# EAGLE design ESC (EAGLE 9.5.1)
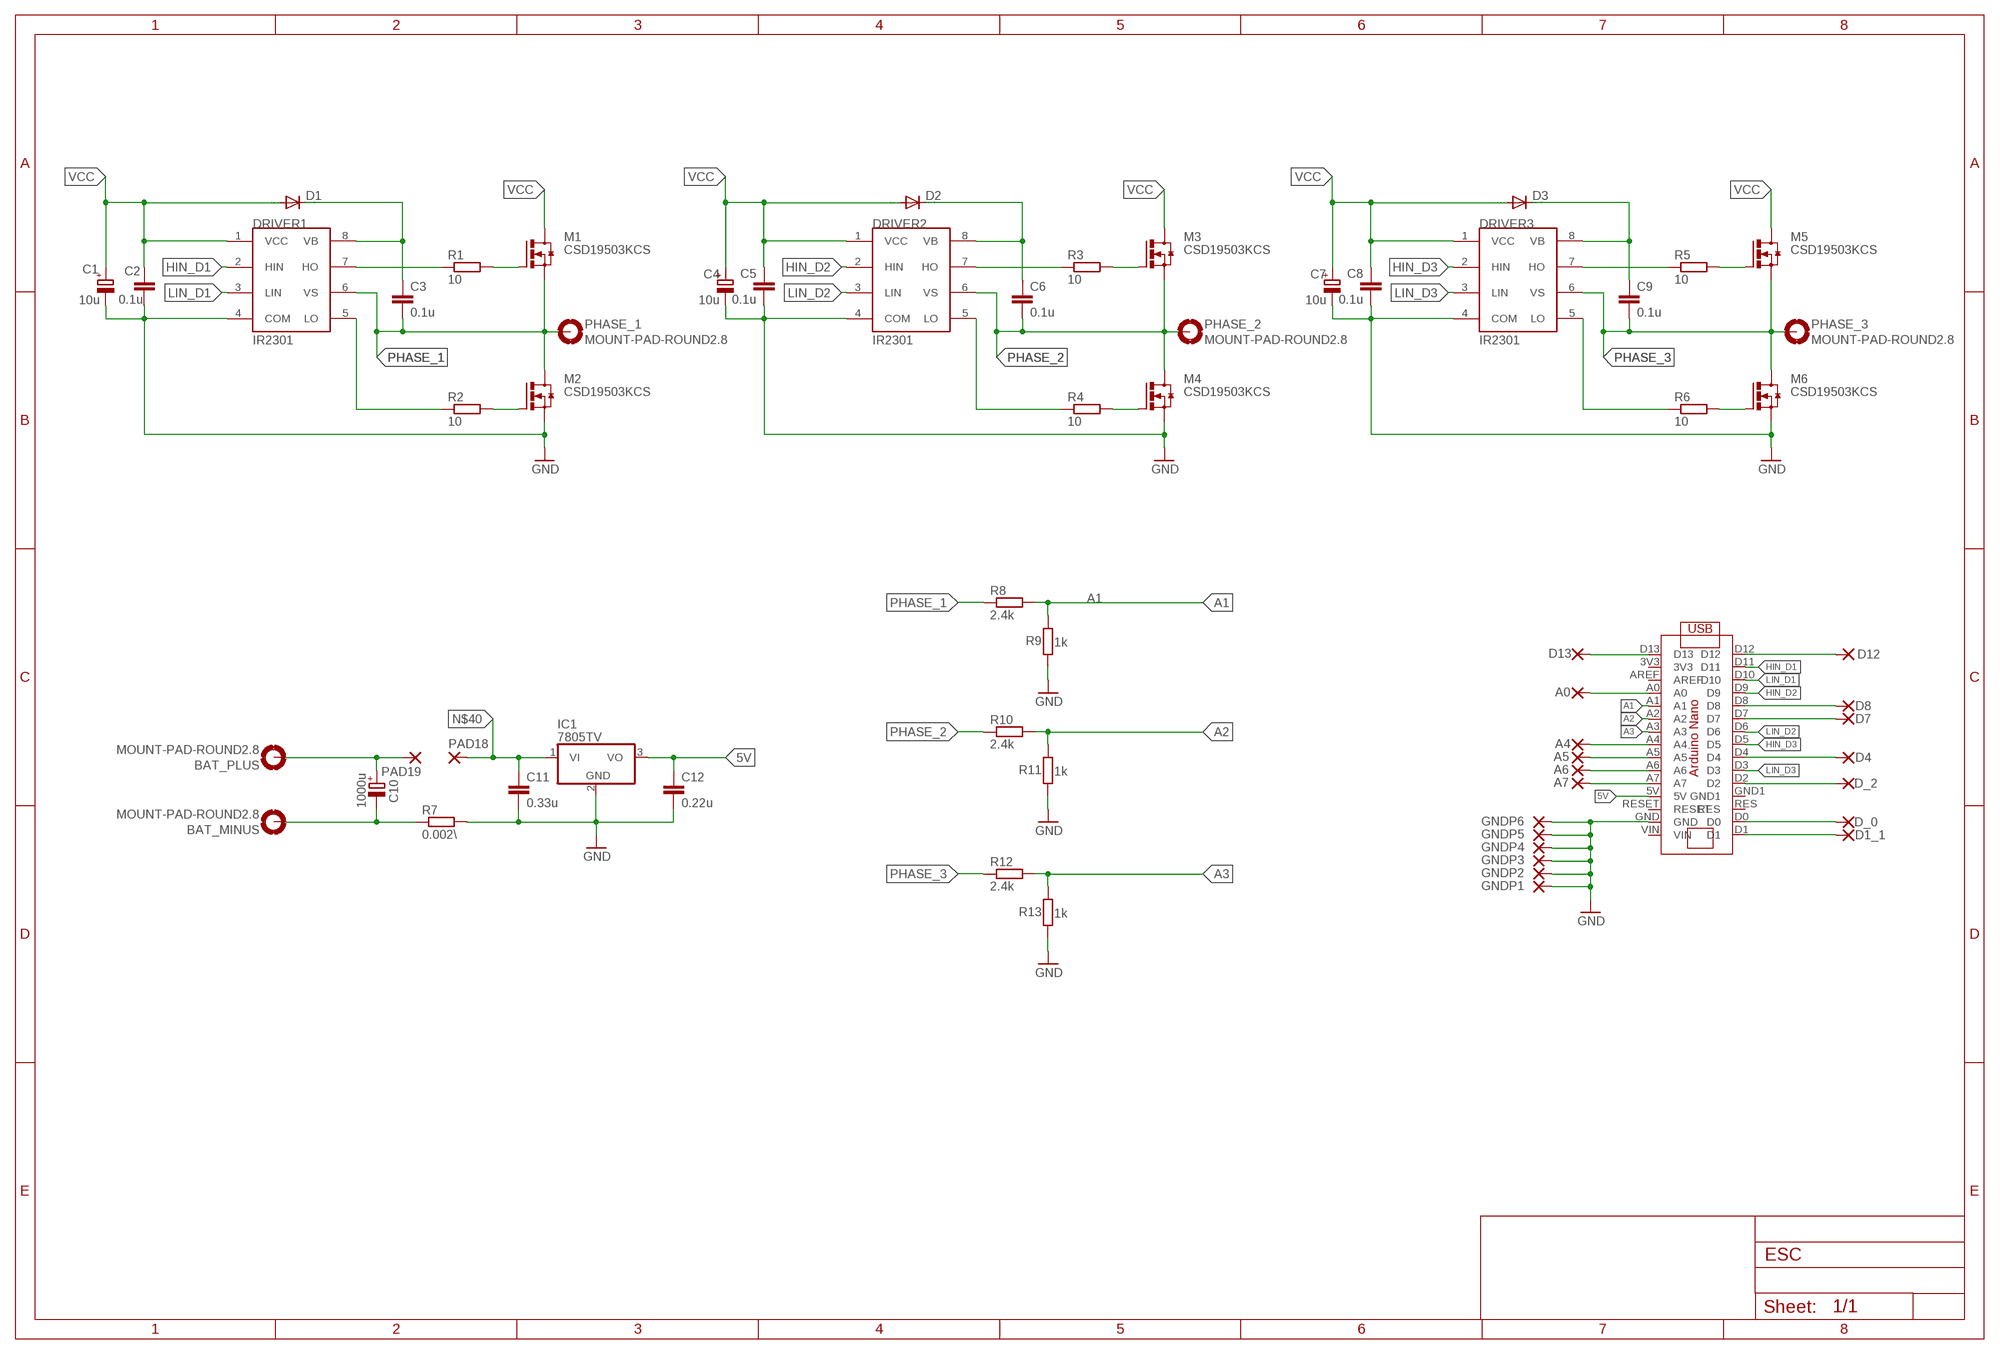
[diagram p0: schematic, sheet 1]

## Parts
A0  3,81/1,4  [3,81/1,4]
A4  3,81/1,4  [3,81/1,4]
A5  3,81/1,4  [3,81/1,4]
A6  3,81/1,4  [3,81/1,4]
A7  3,81/1,4  [3,81/1,4]
BAT_MINUS  MOUNT-PAD-ROUND2.8  [2,8-PAD]
BAT_PLUS  MOUNT-PAD-ROUND2.8  [2,8-PAD]
C1  10u  CPOL-EUC  [PANASONIC_C]
C2  0.1u  CC1206  [C1206]
C3  0.1u  CC1206  [C1206]
C4  10u  CPOL-EUC  [PANASONIC_C]
C5  0.1u  CC1206  [C1206]
C6  0.1u  CC1206  [C1206]
C7  10u  CPOL-EUC  [PANASONIC_C]
C8  0.1u  CC1206  [C1206]
C9  0.1u  CC1206  [C1206]
C10  1000u  CPOL-EUE7.5-16  [E7,5-16]
C11  0.33u  CC1206  [C1206]
C12  0.22u  CC1206  [C1206]
D1  DIODE-DO41-10  [DO41-10]
D1_1  3,81/1,4  [3,81/1,4]
D2  DIODE-DO41-10  [DO41-10]
D3  DIODE-DO41-10  [DO41-10]
D4  3,81/1,4  [3,81/1,4]
D7  3,81/1,4  [3,81/1,4]
D8  3,81/1,4  [3,81/1,4]
D12  3,81/1,4  [3,81/1,4]
D13  3,81/1,4  [3,81/1,4]
D_0  3,81/1,4  [3,81/1,4]
D_2  3,81/1,4  [3,81/1,4]
DRIVER1  IR2301  [DIL08]
DRIVER2  IR2301  [DIL08]
DRIVER3  IR2301  [DIL08]
GNDP1  3,81/1,4  [3,81/1,4]
GNDP2  3,81/1,4  [3,81/1,4]
GNDP3  3,81/1,4  [3,81/1,4]
GNDP4  3,81/1,4  [3,81/1,4]
GNDP5  3,81/1,4  [3,81/1,4]
GNDP6  3,81/1,4  [3,81/1,4]
IC1  7805TV  [TO220V]
M1  CSD19503KCS  [TO220BV]
M2  CSD19503KCS  [TO220BV]
M3  CSD19503KCS  [TO220BV]
M4  CSD19503KCS  [TO220BV]
M5  CSD19503KCS  [TO220BV]
M6  CSD19503KCS  [TO220BV]
PAD18  3,81/1,4  [3,81/1,4]
PAD19  3,81/1,4  [3,81/1,4]
PHASE_1  MOUNT-PAD-ROUND2.8  [2,8-PAD]
PHASE_2  MOUNT-PAD-ROUND2.8  [2,8-PAD]
PHASE_3  MOUNT-PAD-ROUND2.8  [2,8-PAD]
R1  10  R-EU_R1206  [R1206]
R2  10  R-EU_R1206  [R1206]
R3  10  R-EU_R1206  [R1206]
R4  10  R-EU_R1206  [R1206]
R5  10  R-EU_R1206  [R1206]
R6  10  R-EU_R1206  [R1206]
R7  0.002\  R-EU_R2512  [R2512]
R8  2.4k  R-EU_R1206  [R1206]
R9  1k  R-EU_R1206  [R1206]
R10  2.4k  R-EU_R1206  [R1206]
R11  1k  R-EU_R1206  [R1206]
R12  2.4k  R-EU_R1206  [R1206]
R13  1k  R-EU_R1206  [R1206]
U$7  ARDUINO-NANO  [ARDUINO-NANO]

## Nets
5V: C12.1 IC1.3(VO) U$7.5V
A1: R8.2 R9.2 U$7.A1
A2: R10.2 R11.2 U$7.A2
A3: R12.2 R13.2 U$7.A3
BAT_MINUS: BAT_MINUS.B2,8(MOUNT) C10.- R7.1
D22: D_2.1(P) U$7.D2
GND: C1.- C2.2 C4.- C5.2 C7.- C8.2 C11.2 C12.2 DRIVER1.4(COM) DRIVER2.4(COM) DRIVER3.4(COM) GNDP1.1(P) GNDP2.1(P) GNDP3.1(P) GNDP4.1(P) GNDP5.1(P) GNDP6.1(P) IC1.2(GND) M2.S M4.S M6.S R7.2 R9.1 R11.1 R13.1 U$7.GND
HIN_D1: DRIVER1.2(HIN) U$7.D11
HIN_D2: DRIVER2.2(HIN) U$7.D9
HIN_D3: DRIVER3.2(HIN) U$7.D5
LIN_D1: DRIVER1.3(LIN) U$7.D10
LIN_D2: DRIVER2.3(LIN) U$7.D6
LIN_D3: DRIVER3.3(LIN) U$7.D3
N$1: DRIVER2.7(HO) R3.1
N$2: DRIVER2.5(LO) R4.1
N$3: M3.G R3.2
N$4: D13.1(P) U$7.D13
N$5: DRIVER3.7(HO) R5.1
N$6: DRIVER3.5(LO) R6.1
N$9: A0.1(P) U$7.A0
N$10: A4.1(P) U$7.A4
N$11: A5.1(P) U$7.A5
N$12: A6.1(P) U$7.A6
N$13: A7.1(P) U$7.A7
N$14: D4.1(P) U$7.D4
N$15: DRIVER1.7(HO) R1.1
N$16: D7.1(P) U$7.D7
N$17: D8.1(P) U$7.D8
N$18: DRIVER1.5(LO) R2.1
N$19: M4.G R4.2
N$20: M5.G R5.2
N$21: D12.1(P) U$7.D12
N$22: M6.G R6.2
N$24: D_0.1(P) U$7.D0
N$25: D1_1.1(P) U$7.D1
N$26: M1.G R1.2
N$28: M2.G R2.2
N$40: C11.1 IC1.1(VI) PAD18.1(P)
PHASE_1: C3.2 DRIVER1.6(VS) M1.S M2.D PHASE_1.B2,8(MOUNT) R8.1
PHASE_2: C6.2 DRIVER2.6(VS) M3.S M4.D PHASE_2.B2,8(MOUNT) R10.1
PHASE_3: C9.2 DRIVER3.6(VS) M5.S M6.D PHASE_3.B2,8(MOUNT) R12.1
VB1: C3.1 D1.C DRIVER1.8(VB)
VB2: C6.1 D2.C DRIVER2.8(VB)
VB3: C9.1 D3.C DRIVER3.8(VB)
VCC: BAT_PLUS.B2,8(MOUNT) C1.+ C2.1 C4.+ C5.1 C7.+ C8.1 C10.+ D1.A D2.A D3.A DRIVER1.1(VCC) DRIVER2.1(VCC) DRIVER3.1(VCC) M1.D M3.D M5.D PAD19.1(P)
Unconnected: U$7.3V3 U$7.AREF U$7.GND1 U$7.RES U$7.RESET U$7.VIN

## Library data of the parts
A0 A4-A7 D1_1 D4 D7 D8 D12 D13 D_0 D_2 GNDP1-GNDP6 PAD18 PAD19 = wirepad:3,81/1,4: THROUGH-HOLE PAD
BAT_MINUS BAT_PLUS PHASE_1-PHASE_3 = holes:MOUNT-PAD-ROUND: MOUNTING PAD, round
C1 C4 C7 C10 = resistor:CPOL-EU: POLARIZED CAPACITOR, European symbol
C2 C3 C5 C6 C8 C9 C11 C12 = Kondensator.:C: KONDENSATOR
D1-D3 = diode:DIODE-: DIODE
DRIVER1-DRIVER3 = kirill:IR2301: High and low side driver; AVAILABILITY: Unavailable; DESCRIPTION: High and Low Side Driver, Noninverting Inputs; MF: Infineon; MP: IR2301; PACKAGE: DIP-8 International Rectifier; PRICE: None
IC1 = linear:78*: Positive VOLTAGE REGULATOR Source: http://cache.national.com/ds/LM/LM78L05.pdf http://www.fairchildsemi.com/ds/LM/LM7805.pdf
M1 = CSD19503KCS:CSD19503KCS: Power Mosfet, Texas Instrument; SPICEPREFIX: M
M2-M6 = CSD19503KCS:CSD19503KCS: Power Mosfet, Texas Instrument
R1-R6 R8-R13 = Widerstände:R-EU_: RESISTOR; SPICEPREFIX: R
R7 = rcl:R-EU_: RESISTOR, European symbol; SPICEPREFIX: R
U$7 = Arduino-nano:ARDUINO-NANO

## Net classes
1 New Class: width 7 mm, clearance 0.203 mm

## Board
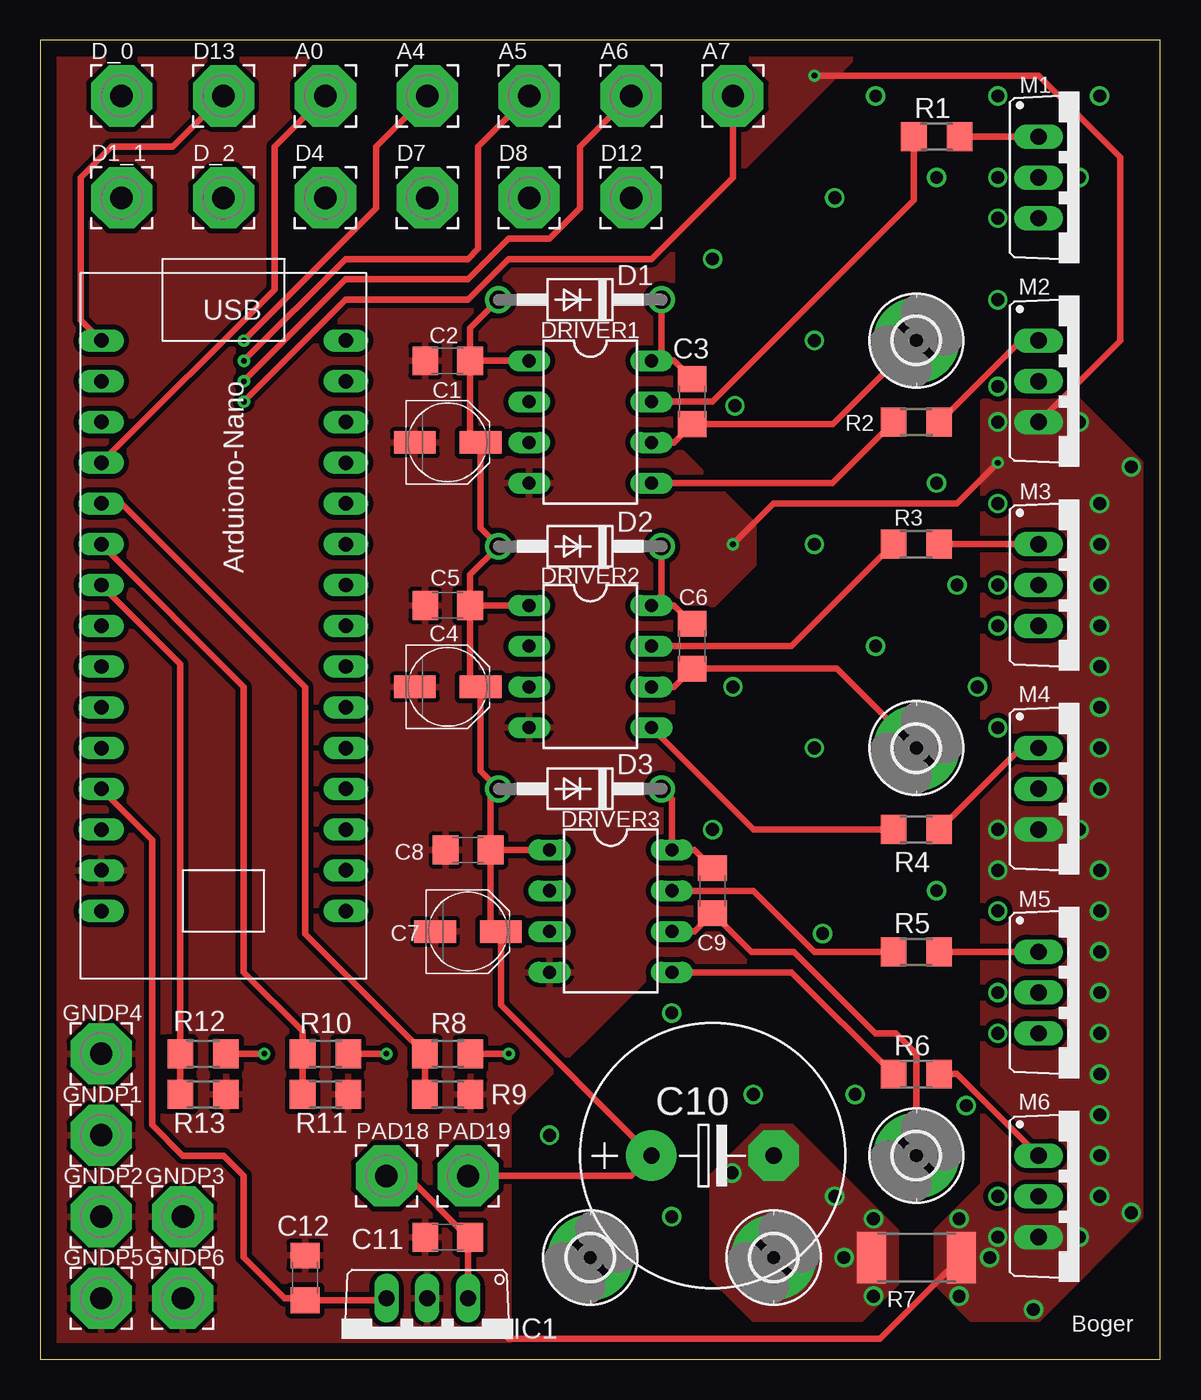
[diagram p1: board, top side]
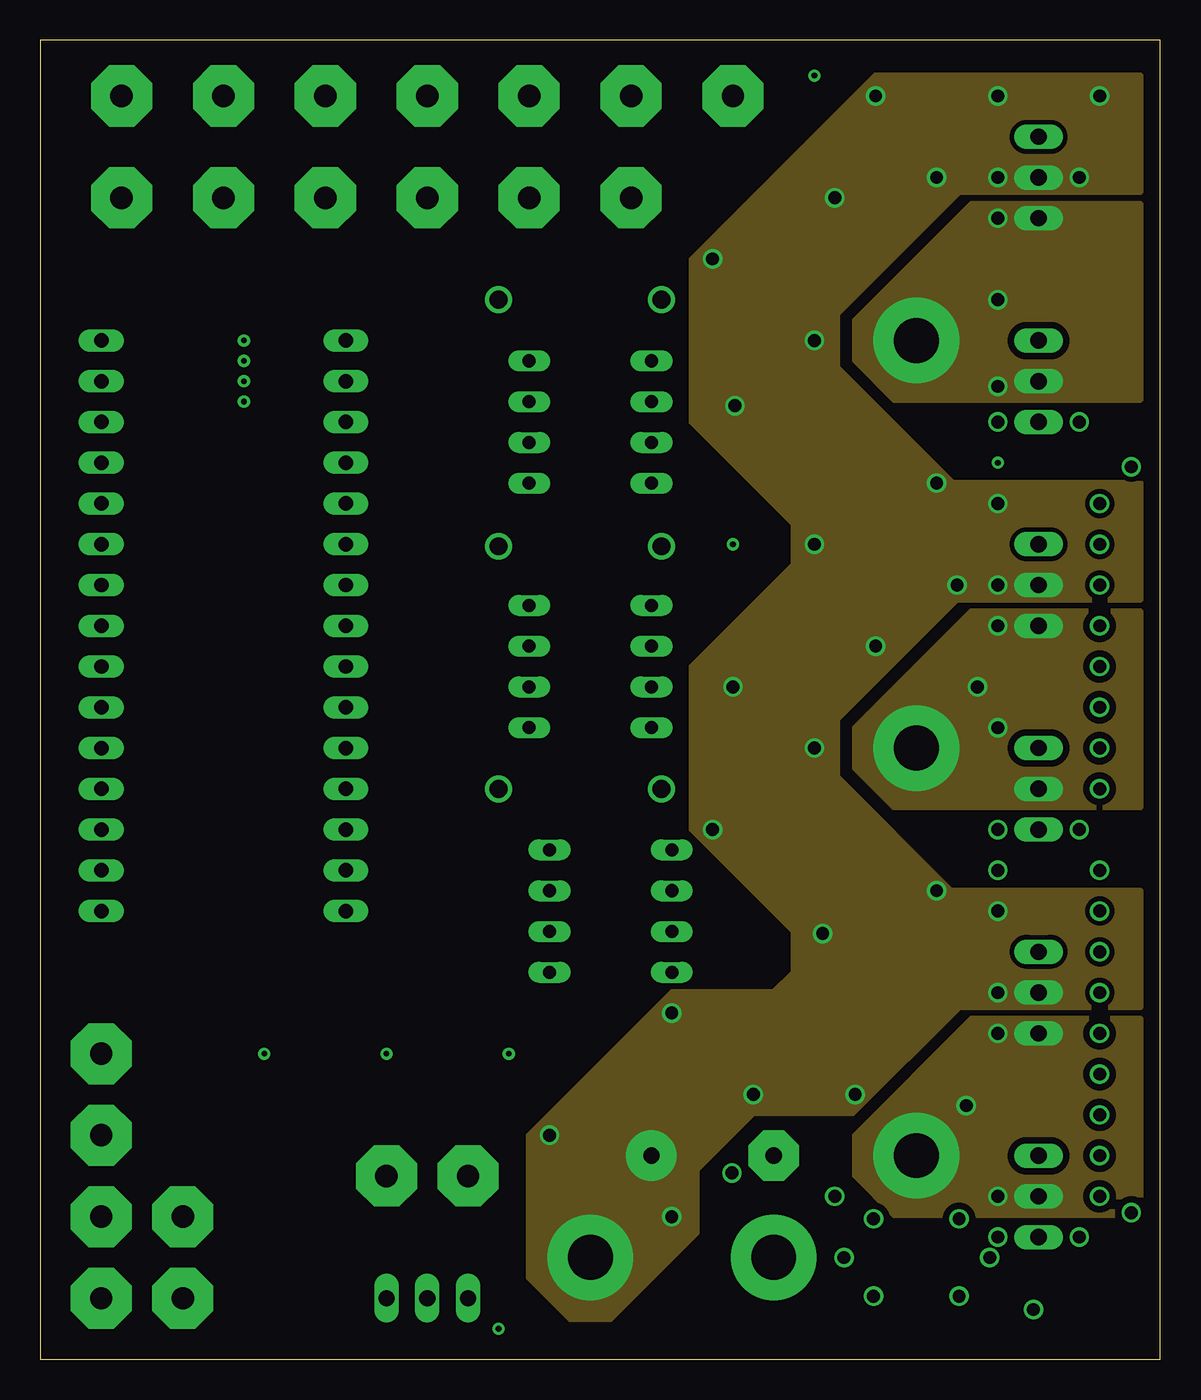
[diagram p2: board, inner layer Route2]
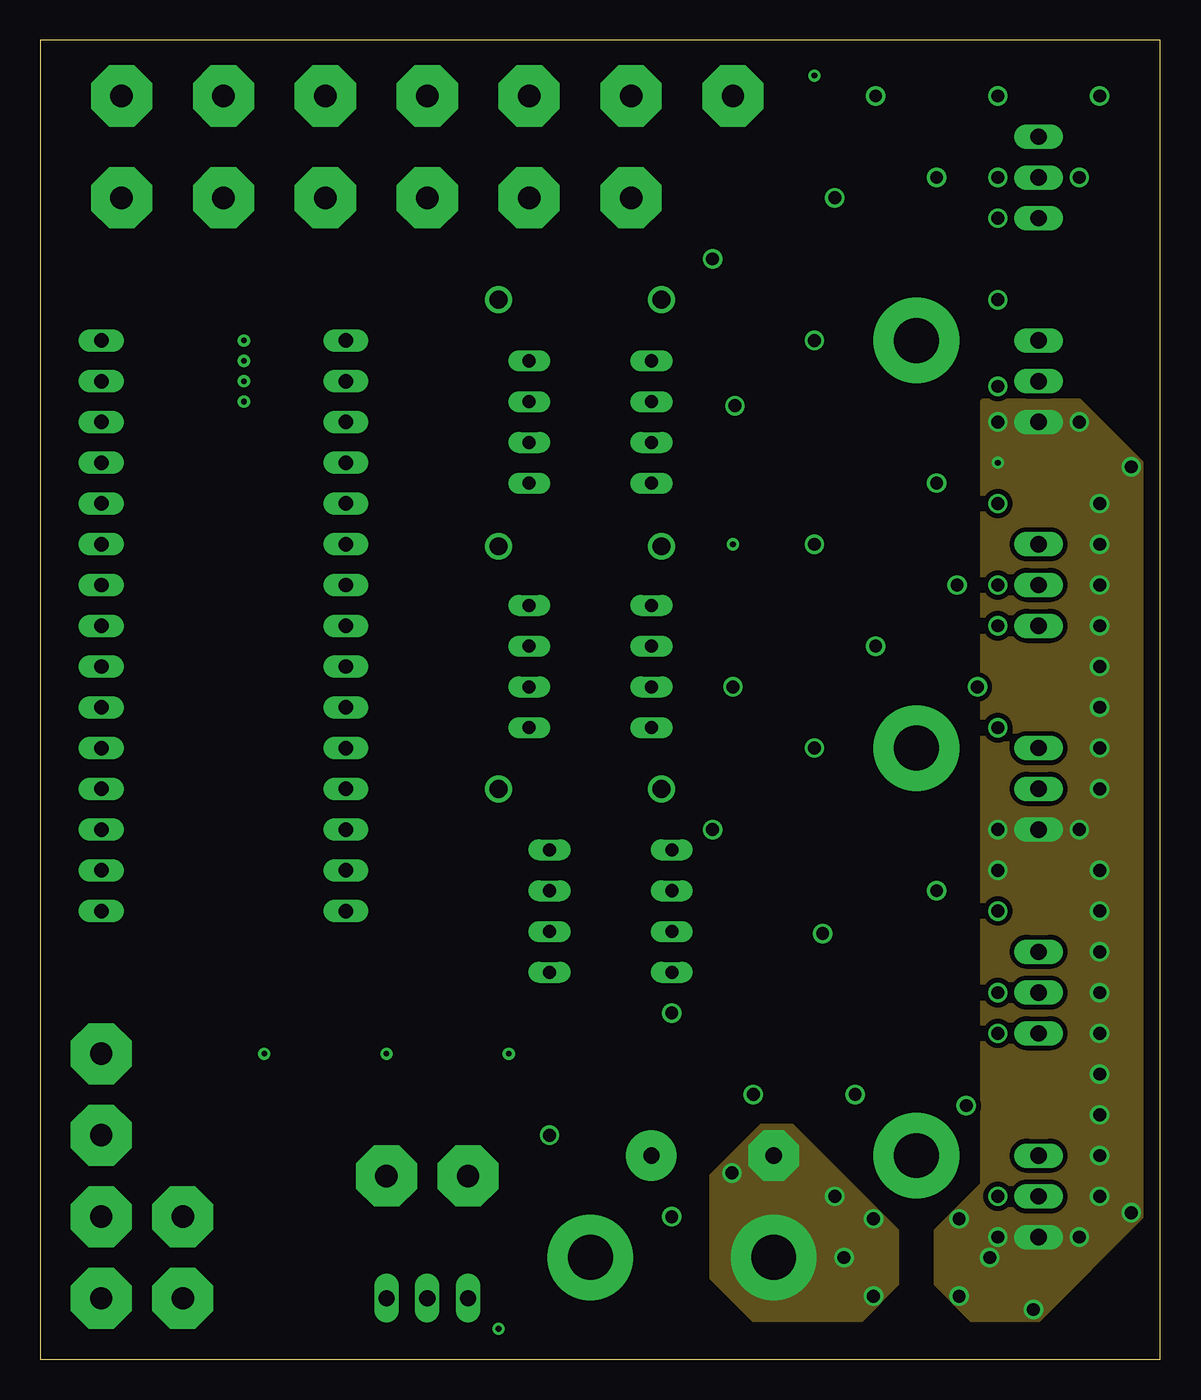
[diagram p3: board, inner layer Route15]
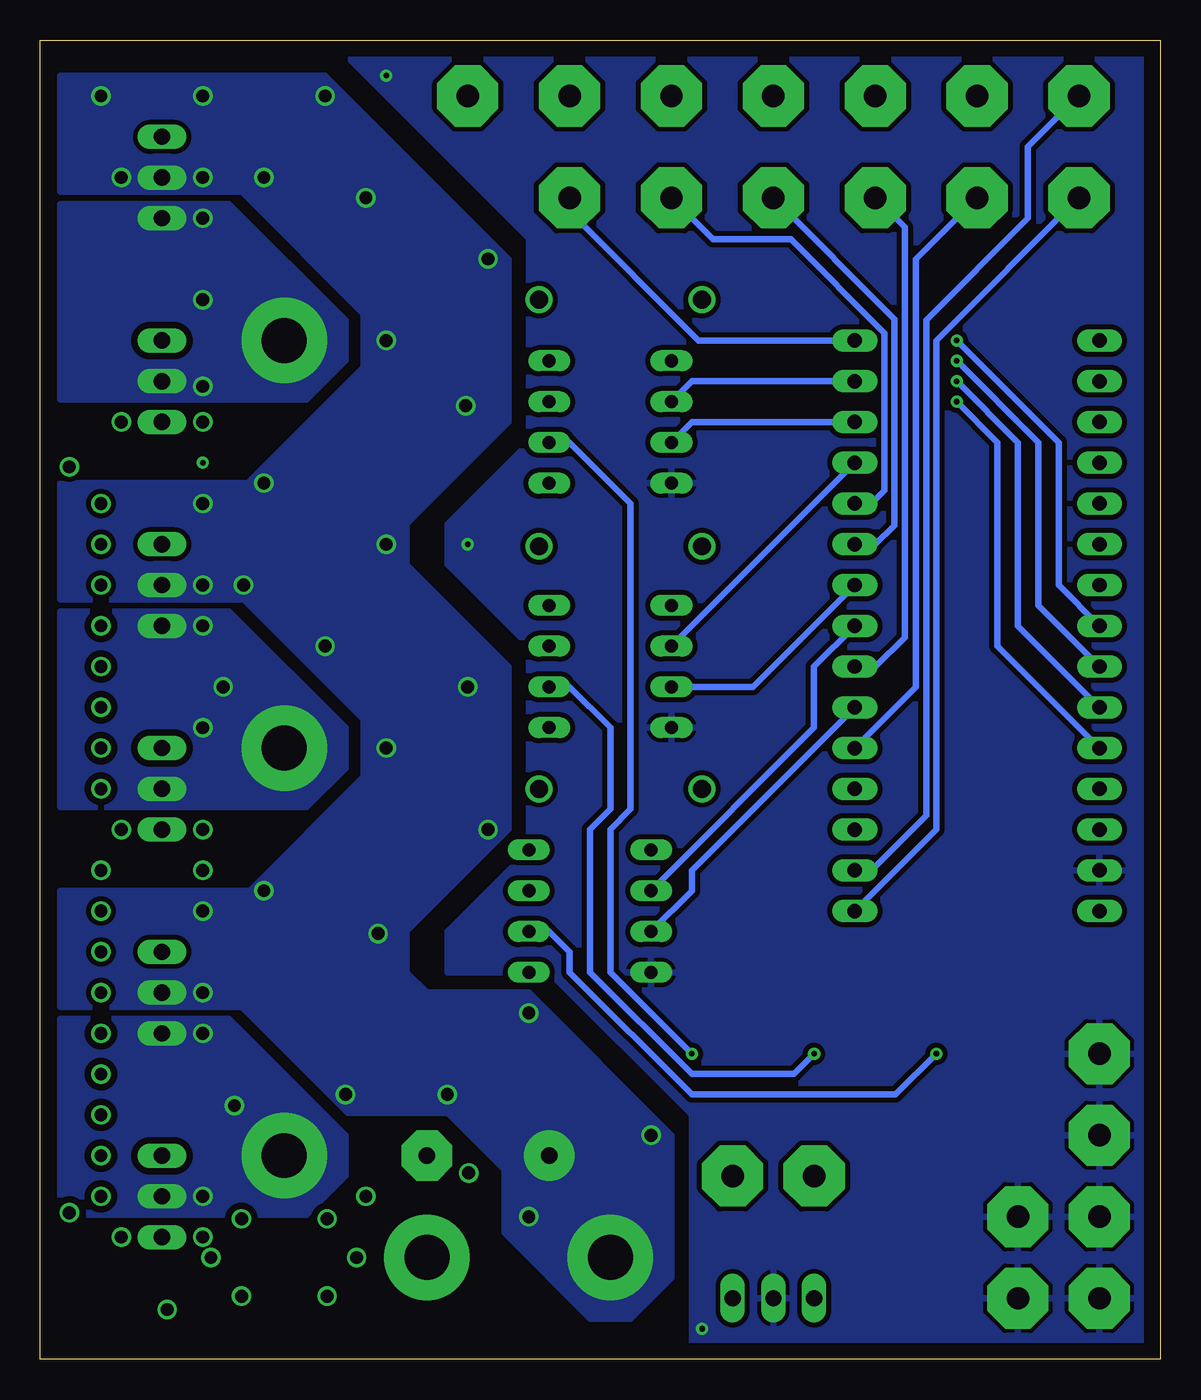
[diagram p4: board, bottom side, seen from below]

Size 69.83 x 82.22 mm. Coordinates in mm from the lower left corner, seen from the top.
Outline: 0,0 69.83,0 69.83,82.22 0,82.22 0,0
Copper layers (1+2*15+16): Top 0.035mm / dielectric 1.5mm / Route2 0.035mm / dielectric 0.15mm / Route15 0.035mm / dielectric 0.2mm / Bottom 0.035mm
Design rules "default *": minimum track width 6mil, minimum drill 0.35mm, track to track 9mil, track to pad 9mil, pad to pad 9mil, via to via 6mil, smd to smd 6mil, copper to edge 40mil, drill to drill 6mil, minimum pad ring 10mil, minimum via ring 8mil, stop-mask expansion 4mil, vias tented up to drill 0mil, thermal gap 10mil

### Footprints (pad centres in the part's own frame; a part is rotated, then mirrored left to right if it is on the bottom)
3,81/1,4 = drill 1.397 pad 3.81 octagon: 1 0,0
2,8-PAD = drill 2.8 pad 5.334: B2,8 0,0
PANASONIC_C = smd 2.6 x 1.4: + 2.05,0; - -2.05,0
C1206 = smd 1.6 x 1.8: 1 -1.4,0; 2 1.4,0
E7,5-16 = drill 1.016 pad 3.15: + -3.81,0 | drill 1.016 pad 3.15 octagon: - 3.81,0
DO41-10 = drill 1.118: A 5.08,0; C -5.08,0
DIL08 = drill 0.813 long: 1 -3.81,-3.81; 2 -1.27,-3.81; 3 1.27,-3.81; 4 3.81,-3.81; 5 3.81,3.81; 6 1.27,3.81; 7 -1.27,3.81; 8 -3.81,3.81
TO220V = drill 1.016 long: 1 -2.54,-2.54; 2 0,-2.54; 3 2.54,-2.54
TO220BV = drill 1.016 long: D 0,-2.54; G -2.54,-2.54; S 2.54,-2.54
R1206 = smd 1.6 x 1.803: 1 -1.422,0; 2 1.422,0
R2512 = smd 1.8 x 3.2: 1 -2.8,0; 2 2.8,0
ARDUINO-NANO = drill 0.9 long: 3V3 -15.24,-7.62; 5V 10.16,-7.62; A0 -10.16,-7.62; A1 -7.62,-7.62; A2 -5.08,-7.62; A3 -2.54,-7.62; A4 0,-7.62; A5 2.54,-7.62; A6 5.08,-7.62; A7 7.62,-7.62; AREF -12.7,-7.62; D0 15.24,7.62; D1 17.78,7.62; D2 7.62,7.62; D3 5.08,7.62; D4 2.54,7.62; D5 0,7.62; D6 -2.54,7.62; D7 -5.08,7.62; D8 -7.62,7.62; D9 -10.16,7.62; D10 -12.7,7.62; D11 -15.24,7.62; D12 -17.78,7.62; D13 -17.78,-7.62; GND 15.24,-7.62; GND1 10.16,7.62; RES 12.7,7.62; RESET 12.7,-7.62; VIN 17.78,-7.62

### Placement (x,y rotation side)
A0  17.78,78.74 0 top
A4  24.13,78.74 0 top
A5  30.48,78.74 0 top
A6  36.83,78.74 0 top
A7  43.18,78.74 0 top
BAT_MINUS  45.72,6.35 0 top
BAT_PLUS  34.29,6.35 0 top
C1  25.4,57.15 0 top
C2  25.4,62.23 180 top
C3  40.64,59.69 270 top
C4  25.4,41.91 0 top
C5  25.4,46.99 180 top
C6  40.64,44.45 270 top
C7  26.67,26.67 0 top
C8  26.67,31.75 180 top
C9  41.91,29.21 270 top
C10  41.91,12.7 0 top
C11  25.4,7.62 180 top
C12  16.51,5.08 90 top
D1  33.66,66.04 180 top
D1_1  5.08,72.39 0 top
D2  33.66,50.67 180 top
D3  33.66,35.56 180 top
D4  17.78,72.39 0 top
D7  24.13,72.39 0 top
D8  30.48,72.39 0 top
D12  36.83,72.39 0 top
D13  11.43,78.74 0 top
D_0  5.08,78.74 0 top
D_2  11.43,72.39 0 top
DRIVER1  34.29,58.42 270 top
DRIVER2  34.29,43.18 270 top
DRIVER3  35.56,27.94 270 top
GNDP1  3.81,13.97 0 top
GNDP2  3.81,8.89 0 top
GNDP3  8.89,8.89 0 top
GNDP4  3.81,19.05 0 top
GNDP5  3.81,3.81 0 top
GNDP6  8.89,3.81 0 top
IC1  24.13,1.27 180 top
M1  64.77,73.66 270 top
M2  64.77,60.96 270 top
M3  64.77,48.26 270 top
M4  64.77,35.56 270 top
M5  64.77,22.86 270 top
M6  64.77,10.16 270 top
PAD18  21.59,11.43 0 top
PAD19  26.67,11.43 0 top
PHASE_1  54.61,63.5 0 top
PHASE_2  54.61,38.1 0 top
PHASE_3  54.61,12.7 0 top
R1  55.88,76.2 0 top
R2  54.61,58.42 0 top
R3  54.61,50.8 0 top
R4  54.61,33.02 0 top
R5  54.61,25.4 0 top
R6  54.61,17.78 0 top
R7  54.61,6.35 0 top
R8  25.4,19.05 180 top
R9  25.4,16.51 180 top
R10  17.78,19.05 180 top
R11  17.78,16.51 180 top
R12  10.16,19.05 180 top
R13  10.16,16.51 180 top
U$7  11.43,45.72 270 top

### Tracks (layer width: path | path; a pad name or v marks a point on that pad's centre or on a via)
5V
  Top 0.406: IC1.3 21.46,3.68 C12.1 16.38,3.81 15.24,3.81 12.7,6.35 12.7,11.43 11.43,12.7 8.89,12.7 6.99,14.61 6.99,32.38 U$7.5V
A1
  Top 0.406: R9.2 R8.2 16.51,26.52 16.51,41.91 5.08,53.34 U$7.A1
A2
  Top 0.406: R11.2 R10.2 16.36,20.47 12.7,24.13 12.7,41.91 U$7.A2
A3
  Top 0.406: R13.2 R12.2 8.74,43.33 U$7.A3
BAT_MINUS  (via drill 0.8)
  other vias: 51.94,8.76 50.1,6.35 51.94,3.94 43.12,11.62 49.53,10.16
  pour Top (isolate 0.305, no thermals): 51.18,2.54 44.45,2.54 41.91,5.08 41.91,11.43 44.96,14.48 46.86,14.48 53.34,8 53.34,4.7
  pour Route15 (isolate 0.305, no thermals): 51.18,2.54 44.45,2.54 41.91,5.08 41.91,11.43 44.96,14.48 46.86,14.48 53.34,8 53.34,4.7
D22
  Bottom 0.406: D_2.1 15.24,68.58 15.24,41.91 U$7.D2
GND  (via drill 0.35, 0.8)
  Top 0.406: R7.2 52.33,1.27 29.21,1.27 v28.57,1.91 | v59.69,55.88 57.15,53.34 45.72,53.34 v43.18,50.8 | M2.S 67.31,63.5 67.31,73.66 67.31,74.93 62.23,80.01 v48.26,80.01
  other vias: 57.28,3.94 59.18,6.35 57.28,8.76 64.77,7.62 66.04,10.16 66.04,12.7 66.04,20.32 66.04,22.86 66.04,25.4 64.77,33.02 66.04,35.56 66.04,38.1 66.04,45.72 66.04,48.26 66.04,50.8 64.77,58.42 59.69,58.42 59.69,7.62 59.69,33.02 66.04,30.48 66.04,27.94 66.04,17.78 66.04,15.24 66.04,40.64 66.04,43.18 59.69,30.48 61.91,3.11 68.01,9.14 68.01,55.63 66.04,53.34
  pour Top (isolate 0.305, no thermals): 55.88,4.7 55.88,8 58.8,10.92 58.8,59.69 64.77,59.69 68.58,55.88 68.58,8.89 62.23,2.54 58.04,2.54
  pour Route15 (isolate 0.305, no thermals): 55.88,4.7 55.88,8 58.8,10.92 58.8,59.69 64.77,59.69 68.58,55.88 68.58,8.89 62.23,2.54 58.04,2.54
  pour Top (isolate 0.305): 0,82.55 50.8,82.55 50.8,81.28 39.37,69.85 39.37,57.15 44.45,52.07 44.45,49.53 39.37,44.45 39.37,31.75 44.45,26.67 44.45,24.13 38.1,24.13 29.21,15.24 29.21,0 0,0
  pour Bottom (isolate 0.305): 0,82.55 50.8,82.55 50.8,81.28 39.37,69.85 39.37,57.15 44.45,52.07 44.45,49.53 39.37,44.45 39.37,31.75 44.45,26.67 44.45,24.13 38.1,24.13 29.21,15.24 29.21,0 0,0
HIN_D1
  Bottom 0.406: DRIVER1.2 29.21,60.96 U$7.D11
HIN_D2
  Bottom 0.406: DRIVER2.2 U$7.D9
HIN_D3
  Bottom 0.406: DRIVER3.2 21.59,39.37 21.59,43.18 U$7.D5
LIN_D1
  Bottom 0.406: DRIVER1.3 29.21,58.42 U$7.D10
LIN_D2
  Bottom 0.406: DRIVER2.3 25.4,41.91 U$7.D6
LIN_D3
  Bottom 0.406: DRIVER3.3 29.21,29.21 29.21,30.48 U$7.D3
N$1
  Top 0.406: R3.1 46.84,44.45 DRIVER2.7
N$2
  Top 0.406: DRIVER2.5 44.45,33.02 R4.1
N$3
  Top 0.406: M3.G R3.2
N$4
  Top 0.406: D13.1 8.26,75.56 4.45,75.56 2.54,73.66 2.54,64.77 U$7.D13
N$5
  Top 0.406: R5.1 48.26,25.4 44.45,29.21 DRIVER3.7
N$6
  Top 0.406: R6.1 46.84,24.13 DRIVER3.5
N$9
  Top 0.406: U$7.A0 14.61,66.67 14.61,75.56 A0.1
N$10  (via drill 0.35)
  Top 0.406: v12.7,63.5 20.95,71.75 20.95,75.56 A4.1
  Bottom 0.406: U$7.A4 6.35,48.26 6.35,57.15 v12.7,63.5
N$11  (via drill 0.35)
  Top 0.406: v12.7,62.23 19.05,68.58 26.67,68.58 27.3,69.22 27.3,75.56 A5.1
  Bottom 0.406: U$7.A5 7.62,46.99 7.62,57.15 v12.7,62.23
N$12  (via drill 0.35)
  Top 0.406: v12.7,60.96 19.05,67.31 26.67,67.31 29.21,69.85 31.75,69.85 33.66,71.75 33.66,75.56 A6.1
  Bottom 0.406: U$7.A6 8.89,45.72 8.89,57.15 v12.7,60.96
N$13  (via drill 0.35)
  Top 0.406: v12.7,59.69 19.05,66.04 26.67,66.04 29.21,68.58 38.1,68.58 43.18,73.66 A7.1
  Bottom 0.406: U$7.A7 10.16,44.45 10.16,57.15 v12.7,59.69
N$14
  Bottom 0.406: D4.1 15.94,70.55 15.94,45 17.76,43.18 U$7.D4
N$15
  Top 0.406: DRIVER1.7 41.91,59.69 54.46,72.24 R1.1
N$16
  Bottom 0.406: U$7.D7 17.76,50.8 16.57,51.98 16.57,64.83 D7.1
N$17
  Bottom 0.406: U$7.D8 18.01,53.34 17.21,54.14 17.21,63.97 23.04,69.8 27.89,69.8 D8.1
N$18
  Top 0.406: R2.1 49.38,54.61 DRIVER1.5
N$19
  Top 0.406: R4.2 61.11,38.1 M4.G
N$20
  Top 0.406: M5.G R5.2
N$21
  Bottom 0.406: D12.1 36.83,71.55 28.78,63.5 U$7.D12
N$22
  Top 0.406: M6.G 57.15,17.78 R6.2
N$24
  Bottom 0.406: U$7.D0 18.01,30.48 14.61,33.88 14.61,64.77 8.26,71.12 8.26,75.56 D_0.1
N$25
  Bottom 0.406: U$7.D1 13.97,33.02 13.97,63.5 D1_1.1
N$26
  Top 0.406: R1.2 M1.G
N$28
  Top 0.406: R2.2 61.11,63.5 M2.G
N$40
  Top 0.406: IC1.1 26.67,7.49 | 26.67,7.49 C11.1 | PAD18.1 22.86,11.43 26.67,7.62 26.67,7.49
PHASE_1  (via drill 0.35, 0.8)
  Top 0.406: DRIVER1.6 39.5,57.15 C3.2 49.4,58.29 PHASE_1.B2,8 | v29.21,19.05 R8.1
  Bottom 0.406: DRIVER1.6 36.83,57.15 33.02,53.34 33.02,34.29 34.29,33.02 34.29,24.13 v29.21,19.05
  other vias: 59.69,60.64 59.69,71.12 59.69,66.04
  pour Bottom (isolate 0.406, no thermals): 68.58,72.01 58.04,72.01 50.8,64.77 50.8,62.23 53.21,59.82 68.58,59.82
  pour Route2 (isolate 0.406, no thermals): 68.58,72.01 58.04,72.01 50.8,64.77 50.8,62.23 53.21,59.82 68.58,59.82
PHASE_2  (via drill 0.35, 0.8)
  Top 0.406: DRIVER2.6 39.5,41.91 C6.2 49.66,43.05 PHASE_2.B2,8 | v21.59,19.05 R10.1
  Bottom 0.406: DRIVER2.6 36.83,41.91 34.29,39.37 34.29,34.29 35.56,33.02 35.56,24.13 29.21,17.78 22.86,17.78 v21.59,19.05
  other vias: 59.69,39.37 59.69,45.72 58.42,41.91
  pour Bottom (isolate 0.406, no thermals): 68.58,46.61 58.04,46.61 50.8,39.37 50.8,36.83 53.21,34.42 68.58,34.42
  pour Route2 (isolate 0.406, no thermals): 68.58,46.61 58.04,46.61 50.8,39.37 50.8,36.83 53.21,34.42 68.58,34.42
PHASE_3  (via drill 0.35, 0.8)
  Top 0.406: DRIVER3.6 40.77,26.67 C9.2 44.32,25.4 46.99,25.4 52.07,20.32 53.34,20.32 54.61,19.05 PHASE_3.B2,8 | v13.97,19.05 R12.1
  Bottom 0.406: DRIVER3.6 38.1,26.67 36.83,25.4 36.83,24.13 29.21,16.51 16.51,16.51 v13.97,19.05
  other vias: 59.69,10.16 59.69,20.32 57.72,15.81
  pour Bottom (isolate 0.406, no thermals): 68.58,21.21 58.04,21.21 50.8,13.97 50.8,11.43 53.21,9.02 68.58,9.02
  pour Route2 (isolate 0.406, no thermals): 68.58,21.21 58.04,21.21 50.8,13.97 50.8,11.43 53.21,9.02 68.58,9.02
VB1
  Top 0.406: C3.1 39.5,62.23 DRIVER1.8 38.73,62.87 D1.C
VB2
  Top 0.406: C6.1 39.5,46.99 DRIVER2.8 38.73,47.62 D2.C
VB3
  Top 0.406: D3.C 39.37,34.92 DRIVER3.8 40.77,31.75 C9.1
VCC  (via drill 0.8)
  Top 0.406: C8.1 28.07,35.05 D3.A 27.45,36.69 C4.+ 26.8,42.56 C5.1 | C8.1 DRIVER3.1 | C8.1 28.07,27.32 C7.+ 28.72,22.08 C10.+ 36.83,11.43 PAD19.1 | DRIVER1.1 C2.1 | C2.1 26.8,57.8 C1.+ 27.45,51.8 D2.A 26.8,48.9 C5.1 | C5.1 DRIVER2.1 | C2.1 26.8,64.27 D1.A
  other vias: 64.77,73.66 59.69,73.66 59.69,48.26 59.69,22.86 57.15,48.26 59.69,53.34 43.31,59.44 41.91,68.58 52.07,78.74 48.26,50.8 43.18,41.91 41.91,33.02 48.77,26.54 39.37,21.59 31.75,13.97 39.37,8.89 50.8,16.51 55.88,29.21 48.26,38.1 52.07,44.45 55.88,54.61 48.26,63.5 55.88,73.66 49.53,72.39 66.04,78.74 59.69,78.74 59.69,27.94 44.45,16.51
  pour Bottom (isolate 0.305, no thermals): 68.58,80.01 68.58,72.77 57.28,72.77 49.66,65.15 49.66,61.85 56.9,54.61 68.58,54.61 68.58,47.37 57.15,47.37 49.66,39.88 49.66,36.32 56.77,29.21 68.58,29.21 68.58,21.97 57.28,21.97 50.67,15.37 44.45,15.37 40.89,11.81 40.89,7.87 35.56,2.54 33.02,2.54 30.48,5.08 30.48,13.97 39.37,22.86 45.72,22.86 46.99,24.13 46.99,26.67 40.64,33.02 40.64,43.18 46.99,49.53 46.99,52.07 40.64,58.42 40.64,68.58 52.07,80.01
  pour Route2 (isolate 0.305, no thermals): 68.58,80.01 68.58,72.77 57.28,72.77 49.66,65.15 49.66,61.85 56.9,54.61 68.58,54.61 68.58,47.37 57.15,47.37 49.66,39.88 49.66,36.32 56.77,29.21 68.58,29.21 68.58,21.97 57.28,21.97 50.67,15.37 44.45,15.37 40.89,11.81 40.89,7.87 35.56,2.54 33.02,2.54 30.48,5.08 30.48,13.97 39.37,22.86 45.72,22.86 46.99,24.13 46.99,26.67 40.64,33.02 40.64,43.18 46.99,49.53 46.99,52.07 40.64,58.42 40.64,68.58 52.07,80.01

### Text on the board
tNames: Boger